# Altium schematic sheet 04-OUTPUT.SchDoc: *OUTPUT
size A; SheetNumber: 3; SheetTotal: 3
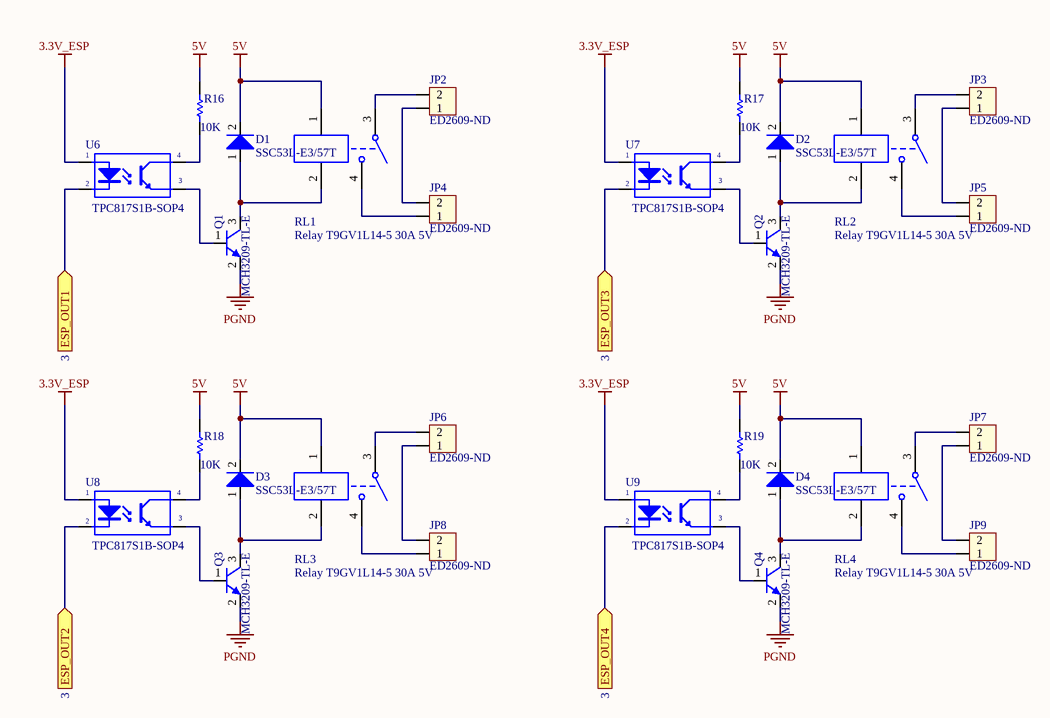
[diagram p0: 04-OUTPUT.SchDoc]

## Parts
D1  SSC53L-E3/57T  [SSC53L-E3/57T]
D2  SSC53L-E3/57T  [SSC53L-E3/57T]
D3  SSC53L-E3/57T  [SSC53L-E3/57T]
D4  SSC53L-E3/57T  [SSC53L-E3/57T]
JP2  ED2609-ND  [DOMINO_OSTTC_2P]
JP3  ED2609-ND  [DOMINO_OSTTC_2P]
JP4  ED2609-ND  [DOMINO_OSTTC_2P]
JP5  ED2609-ND  [DOMINO_OSTTC_2P]
JP6  ED2609-ND  [DOMINO_OSTTC_2P]
JP7  ED2609-ND  [DOMINO_OSTTC_2P]
JP8  ED2609-ND  [DOMINO_OSTTC_2P]
JP9  ED2609-ND  [DOMINO_OSTTC_2P]
Q1  MCH3209-TL-E  [MCH3209-TL-E  SOT-323]
Q2  MCH3209-TL-E  [MCH3209-TL-E  SOT-323]
Q3  MCH3209-TL-E  [MCH3209-TL-E  SOT-323]
Q4  MCH3209-TL-E  [MCH3209-TL-E  SOT-323]
R16  10K  [Res 0805 SMD]
R17  10K  [Res 0805 SMD]
R18  10K  [Res 0805 SMD]
R19  10K  [Res 0805 SMD]
RL1  Relay T9GV1L14-5 30A 5V  [Relay T9GV1L14-5 30A 5V]
RL2  Relay T9GV1L14-5 30A 5V  [Relay T9GV1L14-5 30A 5V]
RL3  Relay T9GV1L14-5 30A 5V  [Relay T9GV1L14-5 30A 5V]
RL4  Relay T9GV1L14-5 30A 5V  [Relay T9GV1L14-5 30A 5V]
U6  TPC817S1B-SOP4  [TPC817-4SOP]
U7  TPC817S1B-SOP4  [TPC817-4SOP]
U8  TPC817S1B-SOP4  [TPC817-4SOP]
U9  TPC817S1B-SOP4  [TPC817-4SOP]

## Ports
ESP_OUT1 (in, see 3), ESP_OUT2 (in, see 3), ESP_OUT3 (in, see 3), ESP_OUT4 (in, see 3)

## Nets
3.3V_ESP: U6.1(A) U7.1(A) U8.1(A) U9.1(A)
5V: D1.2(K) D2.2(K) D3.2(K) D4.2(K) R16.2 R17.2 R18.2 R19.2 RL1.1 RL2.1 RL3.1 RL4.1
PGND: Q1.2(E) Q2.2(E) Q3.2(E) Q4.2(E)
ESP_OUT1: U6.2(K) ; port ESP_OUT1
ESP_OUT2: U8.2(K) ; port ESP_OUT2
ESP_OUT3: U7.2(K) ; port ESP_OUT3
ESP_OUT4: U9.2(K) ; port ESP_OUT4
NetD1_1: D1.1(A) Q1.3(C) RL1.2
NetD2_1: D2.1(A) Q2.3(C) RL2.2
NetD3_1: D3.1(A) Q3.3(C) RL3.2
NetD4_1: D4.1(A) Q4.3(C) RL4.2
NetJP2_1: JP2.1 JP4.2
NetJP2_2: JP2.2 RL1.3
NetJP3_1: JP3.1 JP5.2
NetJP3_2: JP3.2 RL2.3
NetJP4_1: JP4.1 RL1.4
NetJP5_1: JP5.1 RL2.4
NetJP6_1: JP6.1 JP8.2
NetJP6_2: JP6.2 RL3.3
NetJP7_1: JP7.1 JP9.2
NetJP7_2: JP7.2 RL4.3
NetJP8_1: JP8.1 RL3.4
NetJP9_1: JP9.1 RL4.4
NetQ1_1: Q1.1(B) U6.3(E)
NetQ2_1: Q2.1(B) U7.3(E)
NetQ3_1: Q3.1(B) U8.3(E)
NetQ4_1: Q4.1(B) U9.3(E)
NetR16_1: R16.1 U6.4(C)
NetR17_1: R17.1 U7.4(C)
NetR18_1: R18.1 U8.4(C)
NetR19_1: R19.1 U9.4(C)

## Library data of the parts
D1-D4 = 10A10: DIODE SCHOTTKY 30V 5A DO214AB; ComponentLink1Description: Datasheet; ComponentLink1URL: D:\Dropbox\Datasheets\Diodes and Rectifiers\Diodes\10AXX.pdf; Digikey: SSC53L-E3/57TGICT-ND
JP2-JP9 = Con2: 2 Position Wire to Board Terminal Block Horizontal with Board 0.200" (5.08mm) Through Hole; Value: Connector 2; Digikey: ED2609-ND
Q1-Q4 = 2SC1815: Bipolar (BJT) Transistor NPN 30V 3A 450MHz 800mW Surface Mount 3-MCPH; ComponentLink1Description: Datasheet; ComponentLink1URL: D:\Dropbox\Datasheets\Transistors\P Channel Bipolar\2SC1815.pdf; Digikey: MCH3209-TL-EOSCT-ND
R16-R19 = 249K/R0805/1%: RES SMD 249K OHM 1% 1/10W 0805; Manufacturer: Yageo; Manufacturer Part Number: RC0603FR-07249KL; Power (Watts): 0.1W, 1/10W; Temperature Coefficient: ±100ppm/°C; Supplier 1: Digi-Key; RoHS: RoHS Compliant; Category: Resistors; Stock 1: 370515; Pricing 1: 1=0.1, 10=0.015, 100=0.006, 1000=0.00268, 2500=0.00233 (USD); Packaging: Cut Tape (CT); Part Status: Active; Tolerance: ±1%; Composition: Thick Film; Features: Moisture Resistant; Operating Temperature: -55°C ~ 155°C; Package / Case: 0603 (1608 Metric); Supplier Device Package: 0603; Size / Dimension: 0.063" L x 0.032" W (1.60mm x 0.80mm); Height - Seated (Max): 0.022" (0.55mm); Failure Rate: -; ComponentLink1URL: http://www.yageo.com/documents/recent/PYu-RC_Group_51_RoHS_L_8.pdf; ComponentLink1Description: http://www.yageo.com/documents/recent/PYu-RC_Group_51_RoHS_L_8.pdf
RL1-RL4 = Relay T9GV1L14-5 30A 5V: General Purpose Relay SPST-NO (1 Form A) 5VDC Coil Through Hole; Digikey: T9GV1L14-5
U6-U9 = PC817: Optoisolator Transistor Output 5000Vrms 1 Channel 4-SOP; Digikey: TPC817S1BRAGCT-ND